# EAGLE design slenduino_0.8[smd] (EAGLE 6.2)
Slenduino - [V 0.8] Info: creativityslashdesign.tk Developer: Orlando Cosimo Mail: cosmok82@gmail.com
DRAWING_NAME: Slenduino [development board]; LAST_DATE_TIME: 02/12/2013; SHEET: 1
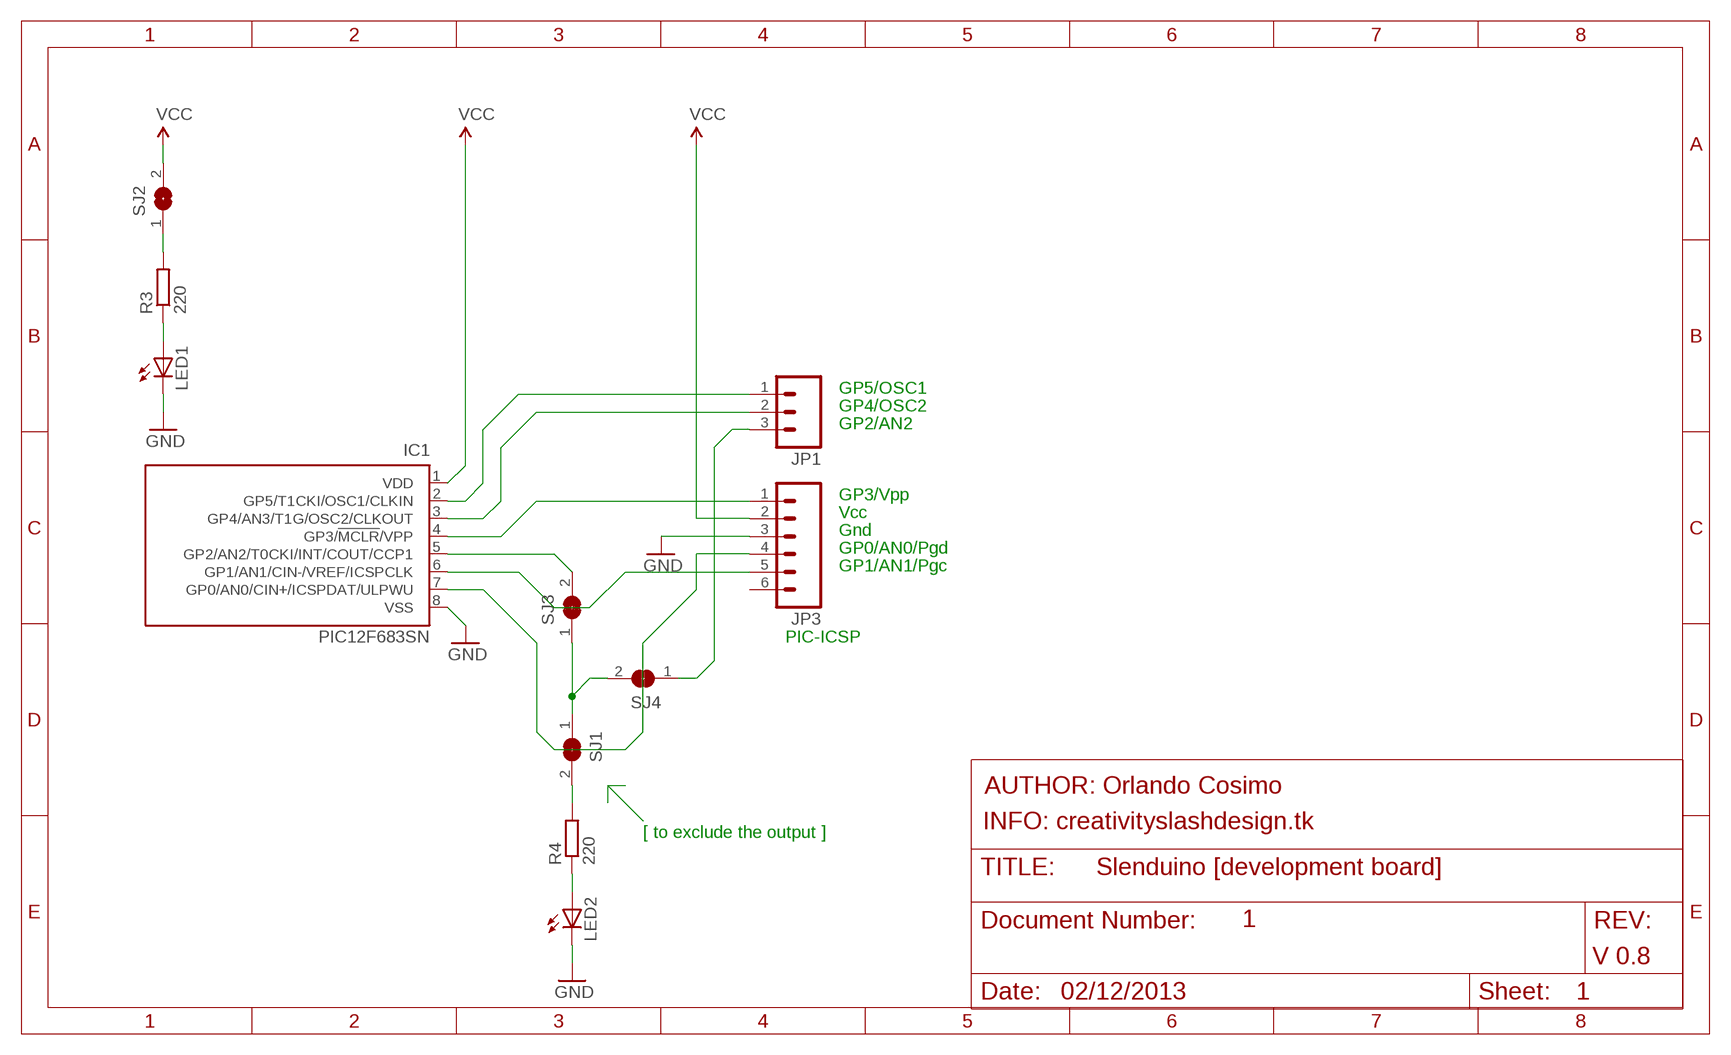
[diagram p0: schematic, sheet 1]

## Parts
IC1  PIC12F683SN  [SO-08]
JP1  M03LOCK_LONGPADS  [1X03_LOCK_LONGPADS]
JP3  M06LOCK_LONGPADS  [1X06_LOCK_LONGPADS]
LED1  LEDCHIPLED_0805  [CHIPLED_0805]
LED2  LEDCHIPLED_0805  [CHIPLED_0805]
R3  220  R-EU_M1406  [M1406]
R4  220  R-EU_M1406  [M1406]
SJ1  SJW  [SJW]
SJ2  SJW  [SJW]
SJ3  SJW  [SJW]
SJ4  SJW  [SJW]

## Nets
GND: IC1.8(VSS) JP3.3 LED1.C LED2.C
N$1: IC1.4(GP3/!MCLR!/VPP) JP3.1
N$2: IC1.6(GP1/AN1/CIN-/VREF/ICSPCLK) JP3.5
N$3: IC1.2(GP5/T1CKI/OSC1/CLKIN) JP1.1
N$4: IC1.5(GP2/AN2/T0CKI/INT/COUT/CCP1) SJ3.2
N$5: IC1.7(GP0/AN0/CIN+/ICSPDAT/ULPWU) JP3.4
N$8: R3.2 SJ2.1
N$9: JP1.3 SJ4.1
N$10: LED2.A R4.1
N$11: LED1.A R3.1
N$14: IC1.3(GP4/AN3/T1G/OSC2/CLKOUT) JP1.2
N$16: R4.2 SJ1.2
N$17: SJ1.1 SJ3.1 SJ4.2
VCC: IC1.1(VDD) JP3.2 SJ2.2
Unconnected: JP3.6

## Notes on the sheet
- GP5/OSC1
- GP4/OSC2
- GP2/AN2
- GP3/Vpp
- Vcc
- Gnd
- GP0/AN0/Pgd
- GP1/AN1/Pgc
- PIC-ICSP
- AUTHOR: Orlando Cosimo
- INFO: creativityslashdesign.tk
- [ to exclude the output ]
- 1
- V 0.8

## Library data of the parts
IC1 = microchip:PIC12F683: 8-Pin Flash-Based, 8-Bit CMOS Microcontrollers with nanoWatt Technology Source: http://ww1.microchip.com/downloads/en/DeviceDoc/41211D_.pdf
JP1 = SparkFun:M03: Header 3 Standard 3-pin 0.1" header. Use with straight break away headers (SKU : PRT-00116), right angle break away headers (PRT-00553), swiss pins (PRT-00743), machine pins (PRT-00117), and female headers (PRT-00115). Molex polarized connector foot print use with SKU : PRT-08232 with associated crimp pins and housings.
JP3 = SparkFun2:M06: Header 6 Standard 6-pin 0.1" header. Use with straight break away headers (SKU : PRT-00116), right angle break away headers (PRT-00553), swiss pins (PRT-00743), machine pins (PRT-00117), and female headers (PRT-00115). Molex polarized connector foot print use with SKU : PRT-08094 with associated crimp pins and housings. NOTES ON THE VARIANTS LOCK and LOCK_LONGPADS... This footprint was designed to help hold the alignment of a through-hole component (i.e. 6-pin header) while soldering it into place. You may notice that each hole has been shifted either up or down by 0.005 of an inch from it's more standard position (which is a perfectly straight line). This slight alteration caused the pins (the squares in the middle) to touch the edges of the holes. Because they are alternating, it causes a "brace" to hold the component in place. 0.005 has proven to be the perfect amount of "off-center" position when using our standard breakaway headers. Although looks a little odd when you look at the bare footprint, once you have a header in there, the alteration is very hard to notice. Also, if you push a header all the way into place, it is covered up entirely on the bottom side. This idea of altering the position of holes to aid alignment will be further integrated into the Sparkfun Library for other footprints. It can help hold any component with 3 or more connection pins.
LED1 LED2 = led:LED: LED OSRAM: - CHIPLED LG R971, LG N971, LY N971, LG Q971, LY Q971, LO R971, LY R971 LH N974, LH R974 LS Q976, LO Q976, LY Q976 LO Q996 - Hyper CHIPLED LW Q18S LB Q993, LB Q99A, LB R99A - SideLED LS A670, LO A670, LY A670, LG A670, LP A670 LB A673, LV A673, LT A673, LW A673 LH A674 LY A675 LS A676, LA A676, LO A676, LY A676, LW A676 LS A679, LY A679, LG A679 - Hyper Micro SIDELED® LS Y876, LA Y876, LO Y876, LY Y876 LT Y87S - SmartLED LW L88C, LW L88S LB L89C, LB L89S, LG L890 LS L89K, LO L89K, LY L89K LS L896, LA L896, LO L896, LY L896 - TOPLED LS T670, LO T670, LY T670, LG T670, LP T670 LSG T670, LSP T670, LSY T670, LOP T670, LYG T670 LG T671, LOG T671, LSG T671 LB T673, LV T673, LT T673, LW T673 LH T674 LS T676, LA T676, LO T676, LY T676, LB T676, LH T676, LSB T676, LW T676 LB T67C, LV T67C, LT T67C, LS T67K, LO T67K, LY T67K, LW E67C LS E67B, LA E67B, LO E67B, LY E67B, LB E67C, LV E67C, LT E67C LW T67C LS T679, LY T679, LG T679 LS T770, LO T770, LY T770, LG T770, LP T770 LB T773, LV T773, LT T773, LW T773 LH T774 LS E675, LA E675, LY E675, LS T675 LS T776, LA T776, LO T776, LY T776, LB T776 LHGB T686 LT T68C, LB T68C - Hyper Mini TOPLED® LB M676 - Mini TOPLED Santana® LG M470 LS M47K, LO M47K, LY M47K Source: http://www.osram.convergy.de LUXEON: - LUMILED® LXK2-PW12-R00, LXK2-PW12-S00, LXK2-PW14-U00, LXK2-PW14-V00 LXK2-PM12-R00, LXK2-PM12-S00, LXK2-PM14-U00 LXK2-PE12-Q00, LXK2-PE12-R00, LXK2-PE12-S00, LXK2-PE14-T00, LXK2-PE14-U00 LXK2-PB12-K00, LXK2-PB12-L00, LXK2-PB12-M00, LXK2-PB14-N00, LXK2-PB14-P00, LXK2-PB14-Q00 LXK2-PR12-L00, LXK2-PR12-M00, LXK2-PR14-Q00, LXK2-PR14-R00 LXK2-PD12-Q00, LXK2-PD12-R00, LXK2-PD12-S00 LXK2-PH12-R00, LXK2-PH12-S00 LXK2-PL12-P00, LXK2-PL12-Q00, LXK2-PL12-R00 Source: www.luxeon.com KINGBRIGHT: KA-3528ASYC Source: www.kingbright.com
R3 R4 = resistor:R-EU_: RESISTOR, European symbol
SJ1-SJ4 = jumper_mod:SJ: SMD solder JUMPER

## Board
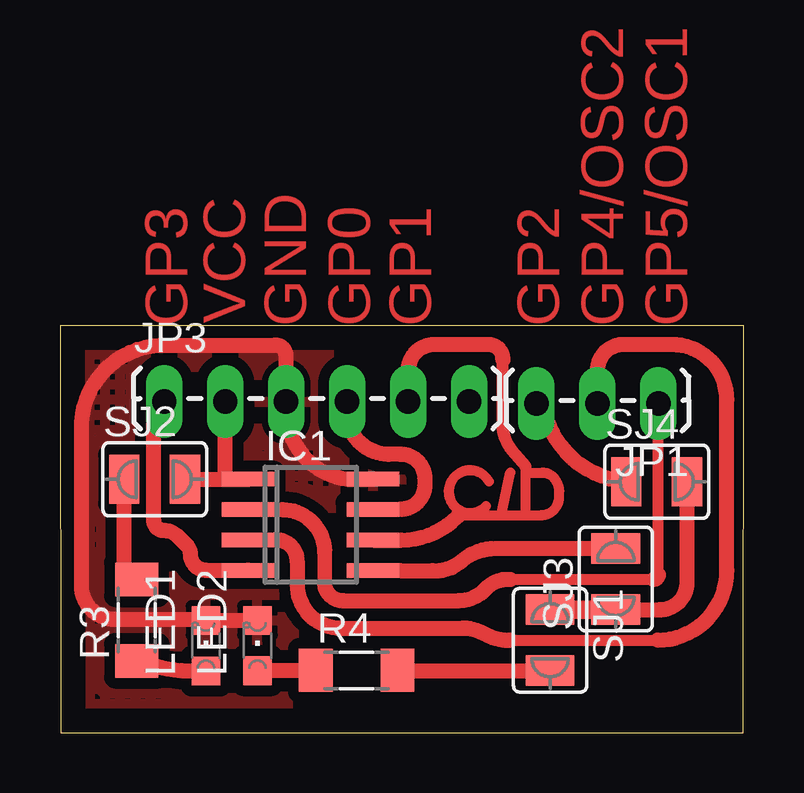
[diagram p1: board, top side]

Size 28.49 x 16.96 mm. Coordinates in mm from the lower left corner, seen from the top.
Outline: 0.02,0 28.48,0 28.49,16.96 0,16.96 0.02,0
Copper layers (1*16): Top 0.035mm / dielectric 1.5mm / Bottom 0.035mm
Design rules: minimum track width 10mil, minimum drill 24mil, track to track 8mil, track to pad 8mil, pad to pad 8mil, via to via 8mil, smd to smd 8mil, copper to edge 40mil, drill to drill 8mil, minimum pad ring 10mil, minimum via ring 8mil, stop-mask expansion 4mil, vias tented up to drill 0mil, thermal gap 10mil

### Footprints (pad centres in the part's own frame; a part is rotated, then mirrored left to right if it is on the bottom)
SO-08 = smd 0.6 x 2.2: 1 -1.905,-2.6; 2 -0.635,-2.6; 3 0.635,-2.6; 4 1.905,-2.6; 5 1.905,2.6; 6 0.635,2.6; 7 -0.635,2.6; 8 -1.905,2.6
1X03_LOCK_LONGPADS = drill 1.016 long: 1 0,0; 2 2.54,0; 3 5.08,0
1X06_LOCK_LONGPADS = drill 1.016 long: 1 0,-0.254; 2 2.54,-0.254; 3 5.08,-0.254; 4 7.62,-0.254; 5 10.16,-0.254; 6 12.7,-0.254
CHIPLED_0805 = smd 1.2 x 1.2: A 0,-1.05; C 0,1.05
M1406 = smd 1.4 x 1.8: 1 -1.7,0; 2 1.7,0
SJW = smd 1.27 x 2.032: 1 -1.27,0; 2 1.27,0

### Placement (x,y rotation side)
IC1  10.44,8.67 270 top
JP1  24.93,13.73 180 top
JP3  4.34,14.06 0 top
LED1  6.08,3.63 0 top
LED2  8.23,3.63 0 top
R3  3.2,4.7 90 top
R4  12.35,2.6 0 top
SJ1  20.42,3.86 270 top
SJ2  3.95,10.57 0 top
SJ3  23.16,6.41 90 top
SJ4  24.86,10.46 0 top

### Tracks (layer width: path | path; a pad name or v marks a point on that pad's centre or on a via)
GND
  Top 0.406: 13.04,10.57 IC1.8 | 9.41,13.95 JP3.3 | 5.89,4.68 LED1.C 6.21,4.68 | 8.96,16.15 8.99,16.15
  Top 0.635: 5.89,4.68 5.72,4.72 2.3,4.72 arc-90 0.9,6.12 0.9,12.6 arc-90 4.2,16.15 8.96,16.15 | 6.21,4.68 LED2.C | 9.41,13.95 9.41,15.74 arc90 8.99,16.15 | 13.04,10.57 12.03,10.57 arc-90 JP3.3
  pour Top (isolate 0.457, hatched): 0.35,16.69 28.29,16.69 28.29,0.3 0.35,0.3
N$1
  Top 0.406: 7.84,6.76 IC1.4 7.83,6.78 | 3.91,13.37 JP3.1
  Top 0.635: 7.83,6.78 6.06,6.78 arc-45 5.64,6.96 arc-45 5.43,7.45 arc45 5.28,7.82 4.93,8.18 arc45 4.31,8.43 arc-90 3.91,8.83 3.91,13.37
N$2
  Top 0.406: 13.05,8.03 IC1.6 13.06,8.05 | 19.4,10.85 19.4,11.1 | 19.4,10.85 20.09,10.85 arc-53 20.61,10.59 20.62,10.58 arc-37 20.8,10.04 20.8,9.85 arc-37 20.63,9.35 arc-53 20.06,9.07 19.4,9.07 | 19.4,9.07 19.4,10.85 | 16.61,9.07 19.4,9.07
  Top 0.508: 19.4,11.1 18.84,11.76 arc-39 18.45,12.86 18.45,15.54
  Top 0.635: JP3.5 14.5,15.09 arc-90 15.59,16.18 17.88,16.18 arc-90 18.45,15.54 | IC1.6 14.21,8.03 arc45 16.55,9 16.61,9.07
N$3
  Top 0.406: IC1.2 9.03,9.31
  Top 0.457: 24.93,6.6 JP1.1 | 18.77,6.4 24.74,6.4
  Top 0.61: 11.02,7.54 11.02,6.27
  Top 0.635: 11.02,6.27 arc90 11.78,5.51 16.63,5.51 arc45 17.68,5.95 17.76,6.03 arc-45 18.66,6.4 18.77,6.4 | 9.03,9.31 9.26,9.3 arc-90 11.02,7.54 | 24.74,6.4 arc90 24.93,6.6
N$4
  Top 0.406: 13.08,6.73 IC1.5 14.17,6.76
  Top 0.635: 14.17,6.76 15.53,6.76 arc45 16.75,7.17 arc-45 18.34,7.68 SJ3.2
N$5
  Top 0.406: 11.96,13.33 JP3.4 | 14.2,9.32 13.06,9.32 arc90 IC1.7
  Top 0.635: 11.96,13.33 arc90 13.69,11.61 14.2,11.61 arc-90 15.21,10.59 15.21,10.34 arc-90 14.2,9.32
N$8
  Top 0.406: 2.68,6.79 arc90 R3.2
  Top 0.635: 2.68,6.79 SJ2.1
N$9
  Top 0.635: JP1.3 20.11,14.59 arc90 SJ4.1
N$10
  Top 0.406: LED2.A arc-90 8.25,2.6
  Top 0.635: 8.25,2.6 R4.1
N$11
  Top 0.635: R3.1 4.19,2.73 arc15 5.34,2.58 LED1.A
N$12
  Top 0.406: 17.88,10.46 arc290 17.75,9.45
N$14
  Top 0.406: 8.99,8.05 7.86,8.05 arc90 IC1.3
  Top 0.457: 18.77,3.86 24.89,3.86
  Top 0.635: 8.99,8.05 arc-90 9.88,7.16 9.88,6.19 arc90 11.7,4.37 16.79,4.37 arc-30 17.64,4.14 arc30 18.7,3.86 18.77,3.86 | JP1.2 22.39,15.11 arc-90 23.47,16.18 25.5,16.18 arc-90 27.79,13.89 27.79,6.76 arc-90 24.89,3.86
N$15
  Top 0.406: 18.39,9.07 18.77,10.85
N$16
  Top 0.406: R4.2 14.32,2.59
  Top 0.635: 14.32,2.59 SJ1.2
N$17
  Top 0.406: 23.17,5.13 arc-90 SJ3.1
  Top 0.635: SJ4.2 26.13,6.27 arc-90 24.99,5.13 23.17,5.13
  Top 0.762: SJ1.1 23.17,5.13
VCC
  Top 0.406: 7.84,10.57 IC1.1 | 6.7,10.57 6.88,10.75
  Top 0.635: SJ2.2 6.7,10.57 7.84,10.57 | 6.88,10.75 JP3.2

### Text on the board
Top: GP3 | VCC | GND | GP0 | GP1 | GP2 | GP4/OSC2 | GP5/OSC1